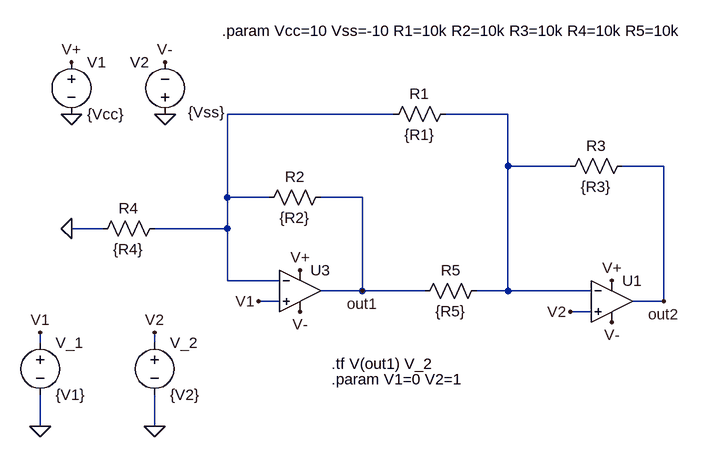
[diagram p0: schematic LAB1_TF.asc]
LAB1_TF.asc, the LTspice schematic file:
Version 4
SHEET 1 1900 680
WIRE 256 -128 0 -128
WIRE 432 -128 336 -128
WIRE 432 -48 432 -128
WIRE 528 -48 432 -48
WIRE 672 -48 608 -48
WIRE 0 0 0 -128
WIRE 64 0 0 0
WIRE 208 0 144 0
WIRE -192 48 -240 48
WIRE 0 48 0 0
WIRE 0 48 -112 48
WIRE 0 128 0 48
WIRE 80 128 0 128
WIRE 208 144 208 0
WIRE 208 144 144 144
WIRE 304 144 208 144
WIRE 432 144 432 -48
WIRE 432 144 384 144
WIRE 560 144 432 144
WIRE 80 160 48 160
WIRE 672 160 672 -48
WIRE 672 160 624 160
WIRE 560 176 528 176
WIRE -288 224 -288 208
WIRE -112 224 -112 208
WIRE -288 352 -288 304
WIRE -112 352 -112 304
FLAG -240 48 0
FLAG 672 160 out2
FLAG 208 144 out1
FLAG 528 176 V2
FLAG 48 160 V1
FLAG -96 -128 0
FLAG -240 -128 0
FLAG -288 352 0
FLAG -112 352 0
FLAG -240 -208 V+
FLAG 112 112 V+
FLAG 592 128 V+
FLAG -96 -208 V-
FLAG 112 176 V-
FLAG 592 192 V-
FLAG -288 208 V1
FLAG -112 208 V2
SYMBOL res 352 -144 R90
WINDOW 0 0 56 VBottom 2
WINDOW 3 32 56 VTop 2
SYMATTR InstName R1
SYMATTR Value {R1}
SYMBOL res 160 -16 R90
WINDOW 0 0 56 VBottom 2
WINDOW 3 32 56 VTop 2
SYMATTR InstName R2
SYMATTR Value {R2}
SYMBOL res 624 -64 R90
WINDOW 0 0 56 VBottom 2
WINDOW 3 32 56 VTop 2
SYMATTR InstName R3
SYMATTR Value {R3}
SYMBOL res -96 32 R90
WINDOW 0 0 56 VBottom 2
WINDOW 3 32 56 VTop 2
SYMATTR InstName R4
SYMATTR Value {R4}
SYMBOL res 400 128 R90
WINDOW 0 0 56 VBottom 2
WINDOW 3 32 56 VTop 2
SYMATTR InstName R5
SYMATTR Value {R5}
SYMBOL OpAmps\\UniversalOpamp2 112 144 R0
SYMATTR InstName U3
SYMATTR SpiceModel level.1
SYMBOL OpAmps\\UniversalOpamp2 592 160 R0
SYMATTR InstName U1
SYMATTR SpiceModel level.1
SYMBOL voltage -240 -224 R0
SYMATTR InstName V1
SYMATTR Value {Vcc}
SYMBOL voltage -96 -112 R180
WINDOW 0 24 96 Left 2
WINDOW 3 -92 19 Left 2
SYMATTR InstName V2
SYMATTR Value {Vss}
SYMBOL voltage -288 208 R0
SYMATTR InstName V_1
SYMATTR Value {V1}
SYMBOL voltage -112 208 R0
WINDOW 123 0 0 Left 0
WINDOW 39 0 0 Left 0
SYMATTR InstName V_2
SYMATTR Value {V2}
TEXT -8 -256 Left 2 !.param Vcc=10 Vss=-10 R1=10k R2=10k R3=10k R4=10k R5=10k
TEXT 160 256 Left 2 !.tf V(out1) V_2
TEXT 160 280 Left 2 !.param V1=0 V2=1

The netlist it stands for:
* LAB1_TF.asc
R1 N002 N001 {R1}
R2 out1 N001 {R2}
R3 out2 N002 {R3}
R4 N001 0 {R4}
R5 N002 out1 {R5}
XU3 V1 N001 V+ V- out1 level.1 Avol=1Meg GBW=10Meg Slew=10Meg ilimit=25m rail=0 Vos=0 phimargin=45 en=0 enk=0 in=0 ink=0 Rin=500Meg  ; pins IN+ IN- V+ V- OUT
XU1 V2 N002 V+ V- out2 level.1 Avol=1Meg GBW=10Meg Slew=10Meg ilimit=25m rail=0 Vos=0 phimargin=45 en=0 enk=0 in=0 ink=0 Rin=500Meg  ; pins IN+ IN- V+ V- OUT
V1 V+ 0 {Vcc}
V2 0 V- {Vss}
V_1 V1 0 {V1}
V_2 V2 0 {V2}
.param Vcc=10 Vss=-10 R1=10k R2=10k R3=10k R4=10k R5=10k
.tf V(out1) V_2
.param V1=0 V2=1
.lib UniversalOpamps2.sub
.backanno
.end